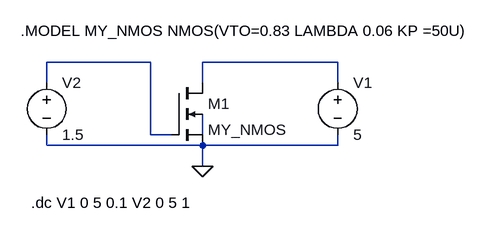
[diagram p0: schematic Draft1.asc]
Draft1.asc, the LTspice schematic file:
Version 4
SHEET 1 880 680
WIRE 112 64 -48 64
WIRE 400 64 192 64
WIRE -48 96 -48 64
WIRE 192 96 192 64
WIRE 400 96 400 64
WIRE 112 176 112 64
WIRE 144 176 112 176
WIRE 192 176 192 144
WIRE -48 192 -48 176
WIRE 192 192 -48 192
WIRE 400 192 400 176
WIRE 400 192 192 192
WIRE 192 224 192 192
FLAG 192 224 0
SYMBOL nmos4 144 96 R0
SYMATTR InstName M1
SYMATTR Value MY_NMOS
SYMATTR Value2 l=5um w=10um
SYMBOL voltage 400 80 R0
SYMATTR InstName V1
SYMATTR Value 5
SYMBOL voltage -48 80 R0
SYMATTR InstName V2
SYMATTR Value 1.5
TEXT -88 16 Left 2 !.MODEL MY_NMOS NMOS(VTO=0.83 LAMBDA 0.06 KP =50U)
TEXT -72 280 Left 2 !.dc V1 0 5 0.1 V2 0 5 1

The netlist it stands for:
* Draft1.asc
M1 N002 N001 0 N003 MY_NMOS l=5um w=10um
V1 N002 0 5
V2 N001 0 1.5
.model NMOS NMOS
.model PMOS PMOS
.lib standard.mos
.MODEL MY_NMOS NMOS(VTO=0.83 LAMBDA 0.06 KP =50U)
.dc V1 0 5 0.1 V2 0 5 1
.backanno
.end